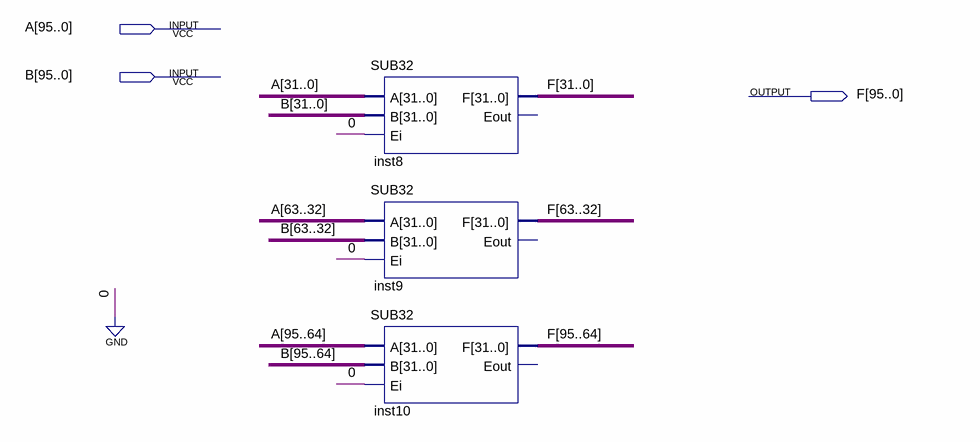
[diagram p0: schematic sheet]
// Quartus schematic vec3_subtract.bdf as structural Verilog: 3 symbols, 3 pins
module vec3_subtract (
  input  [95:0] A,
  input  [95:0] B,
  output [95:0] F
);

  SUB32 inst8 (.A(A[31:0]), .B(B[31:0]), .Ei(1'b0), .F(F[31:0]));  // open: Eout
  SUB32 inst9 (.A(A[63:32]), .B(B[63:32]), .Ei(1'b0), .F(F[63:32]));  // open: Eout
  SUB32 inst10 (.A(A[95:64]), .B(B[95:64]), .Ei(1'b0), .F(F[95:64]));  // open: Eout
endmodule
